# Altium schematic sheet EEPROM&RTC.SchDoc
size A4; SheetNumber: 6; SheetTotal: 6
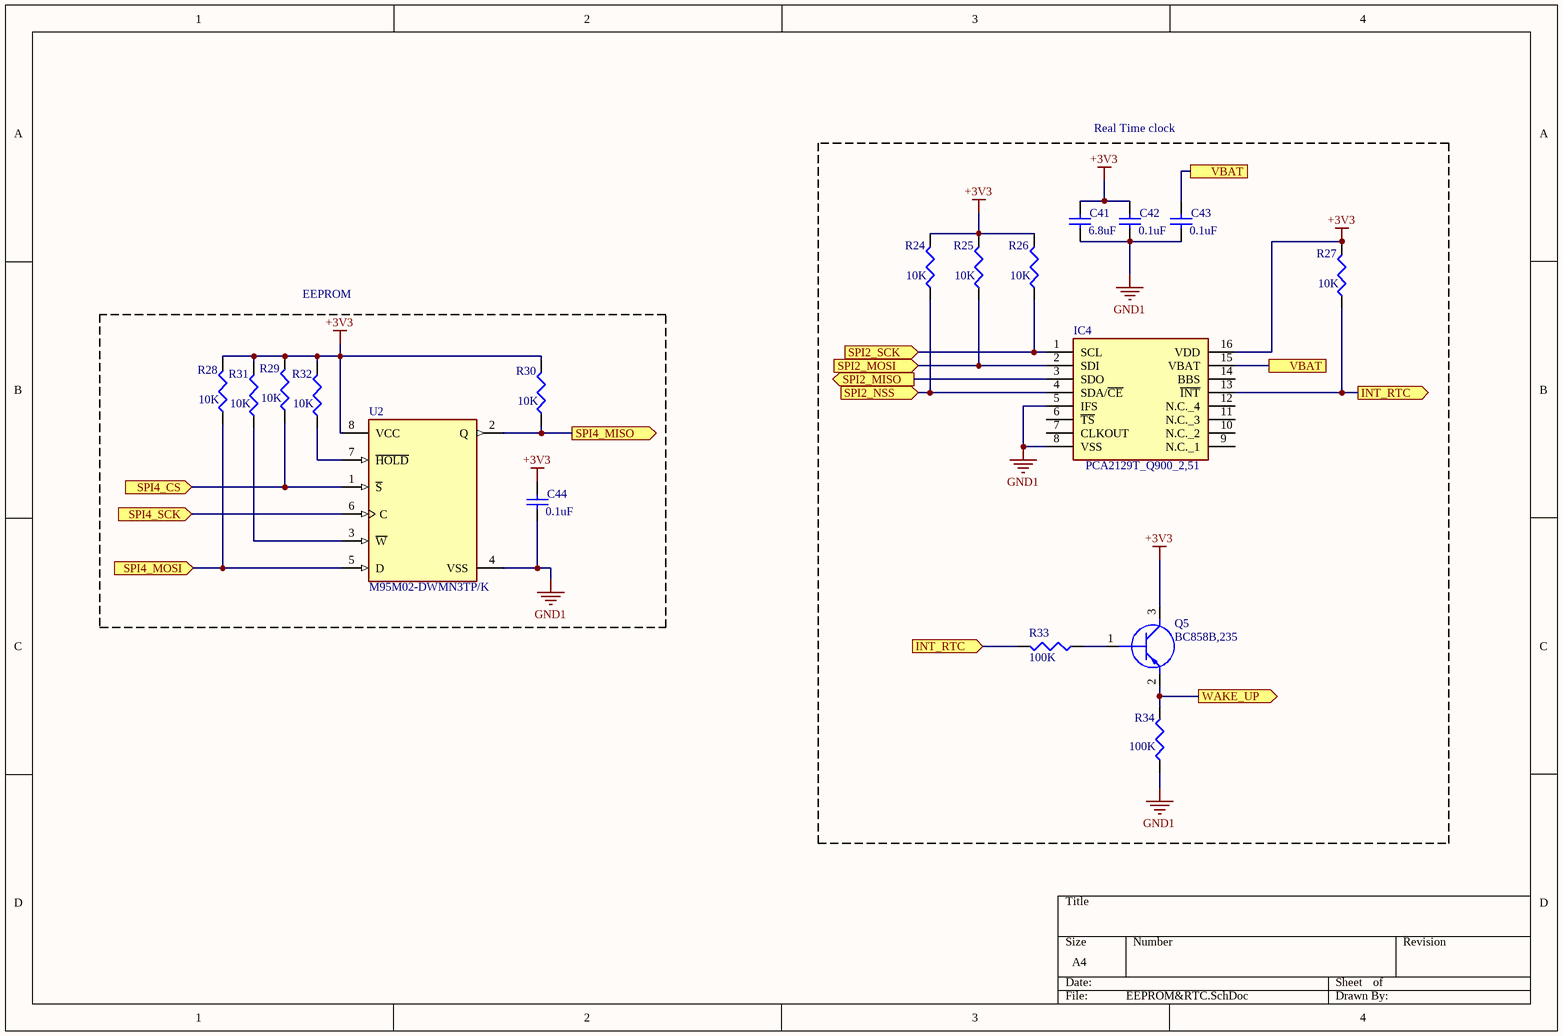
[diagram p0: EEPROM&RTC.SchDoc]

## Parts
C41  value 6.8uF  [1608[0603]]  (hidden comment: Cap Semi)
C42  value 0.1uF  [1608[0603]]  (hidden comment: Cap Semi)
C43  value 0.1uF  [1608[0603]]  (hidden comment: Cap Semi)
C44  value 0.1uF  [1608[0603]]  (hidden comment: Cap Semi)
IC4  PCA2129T_Q900_2,51  [SOIC127P1032X265-16N]
Q5  BC858B,235  [SOT95P230X110-3N]
R24  value 10K  [J1-0603]  (hidden comment: Res3)
R25  value 10K  [J1-0603]  (hidden comment: Res3)
R26  value 10K  [J1-0603]  (hidden comment: Res3)
R27  value 10K  [J1-0603]  (hidden comment: Res3)
R28  value 10K  [J1-0603]  (hidden comment: Res3)
R29  value 10K  [J1-0603]  (hidden comment: Res3)
R30  value 10K  [J1-0603]  (hidden comment: Res3)
R31  value 10K  [J1-0603]  (hidden comment: Res3)
R32  value 10K  [J1-0603]  (hidden comment: Res3)
R33  value 100K  [J1-0603]  (hidden comment: Res3)
R34  value 100K  [J1-0603]  (hidden comment: Res3)
U2  M95M02-DWMN3TP/K  [FP-SO8N-SO-A-MFG]

## Blocks framed on the sheet
Real Time clock: C41-C43 IC4 Q5 R24-R27 R33 R34
EEPROM: C44 R28-R32 U2

## Ports
INT_RTC (in), INT_RTC (out), SPI2_MISO (out), SPI2_MOSI (in), SPI2_NSS (in), SPI2_SCK (in), SPI4_CS (in), SPI4_MISO (out), SPI4_MOSI (in), SPI4_SCK (in), VBAT, WAKE_UP (out)

## Nets
+3V3: C41.2 C42.2 C44.2 IC4.16(VDD) Q5.3(C) R24.2 R25.2 R26.2 R27.2 R28.2 R29.2 R30.2 R31.2 R32.2 U2.8(VCC)
GND1: C41.1 C42.1 C43.1 C44.1 IC4.5(IFS) IC4.8(VSS) R34.1 U2.4(VSS)
INT_RTC: IC4.13(~{INT}) R27.1 R33.2 ; port INT_RTC
SPI2_MISO: IC4.3(SDO) ; port SPI2_MISO
SPI2_MOSI: IC4.2(SDI) R25.1 ; port SPI2_MOSI
SPI2_NSS: IC4.4(SDA/~{CE}) R24.1 ; port SPI2_NSS
SPI2_SCK: IC4.1(SCL) R26.1 ; port SPI2_SCK
SPI4_CS: R29.1 U2.1(~{S}) ; port SPI4_CS
SPI4_MISO: R30.1 U2.2(Q) ; port SPI4_MISO
SPI4_MOSI: R28.1 U2.5(D) ; port SPI4_MOSI
SPI4_SCK: U2.6(C) ; port SPI4_SCK
VBAT: C43.2 IC4.15(VBAT) ; port VBAT
WAKE_UP: Q5.2(E) R34.2 ; port WAKE_UP
NetQ5_1: Q5.1(B) R33.1
NetR31_1: R31.1 U2.3(~{W})
NetR32_1: R32.1 U2.7(~{HOLD})

Not connected (* = marked no-connect by the designer): IC4 6(~{TS}) 7(CLKOUT) 9(N.C._1) 10(N.C._2) 11(N.C._3) 12(N.C._4) 14(BBS)

## Library data of the parts
C41-C44 = Cap Semi: Capacitor (Semiconductor SIM Model); Published: 8-Jun-2000; LatestRevisionDate: 29-May-2009; LatestRevisionNote: IPC-7351 Footprint Added.; PackageReference: C1206; Publisher: Altium Limited; PackageDescription: Chip Capacitor
IC4 = PCA2129T_Q900_2,51: Integrated Circuit; Manufacturer_Name: NXP; Manufacturer_Part_Number: PCA2129T/Q900/2,51; Datasheet Link: http://www.nxp.com/docs/en/data-sheet/PCA2129.pdf; Height: 2.65mm; Mouser Part Number: 771-PCA2129TQ900251; Mouser Price/Stock: https://www.mouser.co.uk/ProductDetail/NXP-Semiconductors/PCA2129T-Q900-251?qs=cbprxTG2Yq%2F%2FjRzXwigwjQ%3D%3D; Arrow Part Number: PCA2129T/Q900/2,51; Arrow Price/Stock: https://www.arrow.com/en/products/pca2129tq900251/nxp-semiconductors
Q5 = BC858B,235: Transistor BJT PNP; Manufacturer_Name: Nexperia; Datasheet Link: http://assets.nexperia.com/documents/data-sheet/BC856_BC857_BC858.pdf; Height: 1.1mm; Manufacturer_Part_Number: BC858B,235; Mouser Part Number: 771-BC858B235; Mouser Price/Stock: https://www.mouser.co.uk/ProductDetail/Nexperia/BC858B235/?qs=me8TqzrmIYXYzaJ2wqapBg%3D%3D; Arrow Part Number: BC858B,235; Arrow Price/Stock: https://www.arrow.com/en/products/bc858b235/nexperia
R24-R34 = Res3: Resistor; Published: 8-Jun-2000; LatestRevisionDate: 29-May-2009; LatestRevisionNote: IPC-7351 Footprint Added.; PackageReference: J1-0603; Publisher: Altium Limited; PackageDescription: Chip Resistor
U2 = CMP-12142-000005-1: IC EEPROM 2M SPI 10MHZ 8SO; Manufacturer: STMicroelectronics; Nominal Supply Current: 2-5mA; Min Supply Voltage: 2.5V; Standoff Height: 0.1mm; Access Time: 80ns; Automotive Grade: Grade 0; Max Supply Voltage: 5.5V; Frequency: 5MHz; Memory Size: 2Mbits; Manufacturer Part Number: M95M02-DWMN3TP/K; RoHS: TRUE; Ipc Land Pattern Name: SOIC127P600X175-8; Temperature Range Low: -40°C; Mouser Description: STMICROELECTRONICS - M95M02-DWMN3TP/K - EEPROM, AEC-Q100, 2MBIT, SPI, SOIC-8; Device Class L2: Memory; Lead Free: Yes; Octopart: https://octopart.com/m95m02-dwmn3tp%2Fk-stmicroelectronics-52112703; Automotive: Yes; Category: IC; Package: SO8N-SO-A; Temperature Range High: +125°C; ComponentLink2URL: https://www.st.com/resource/en/datasheet/m95m02-a125.pdf; Device Class L1: Integrated Circuits (ICs); Temperature: -40°C to +125°C; Memory Type: EEPROM; Device Class L3: EEPROM; Ambient Temperature Range Low: -40°C; ComponentLink2Description: Datasheet; Digikey Description: IC EEPROM 2M SPI 10MHZ 8SO; Height: 1.75mm; Interface: SPI; Ambient Temperature Range High: +125°C